# Altium schematic sheet BMS_rev2.SchDoc
size A4
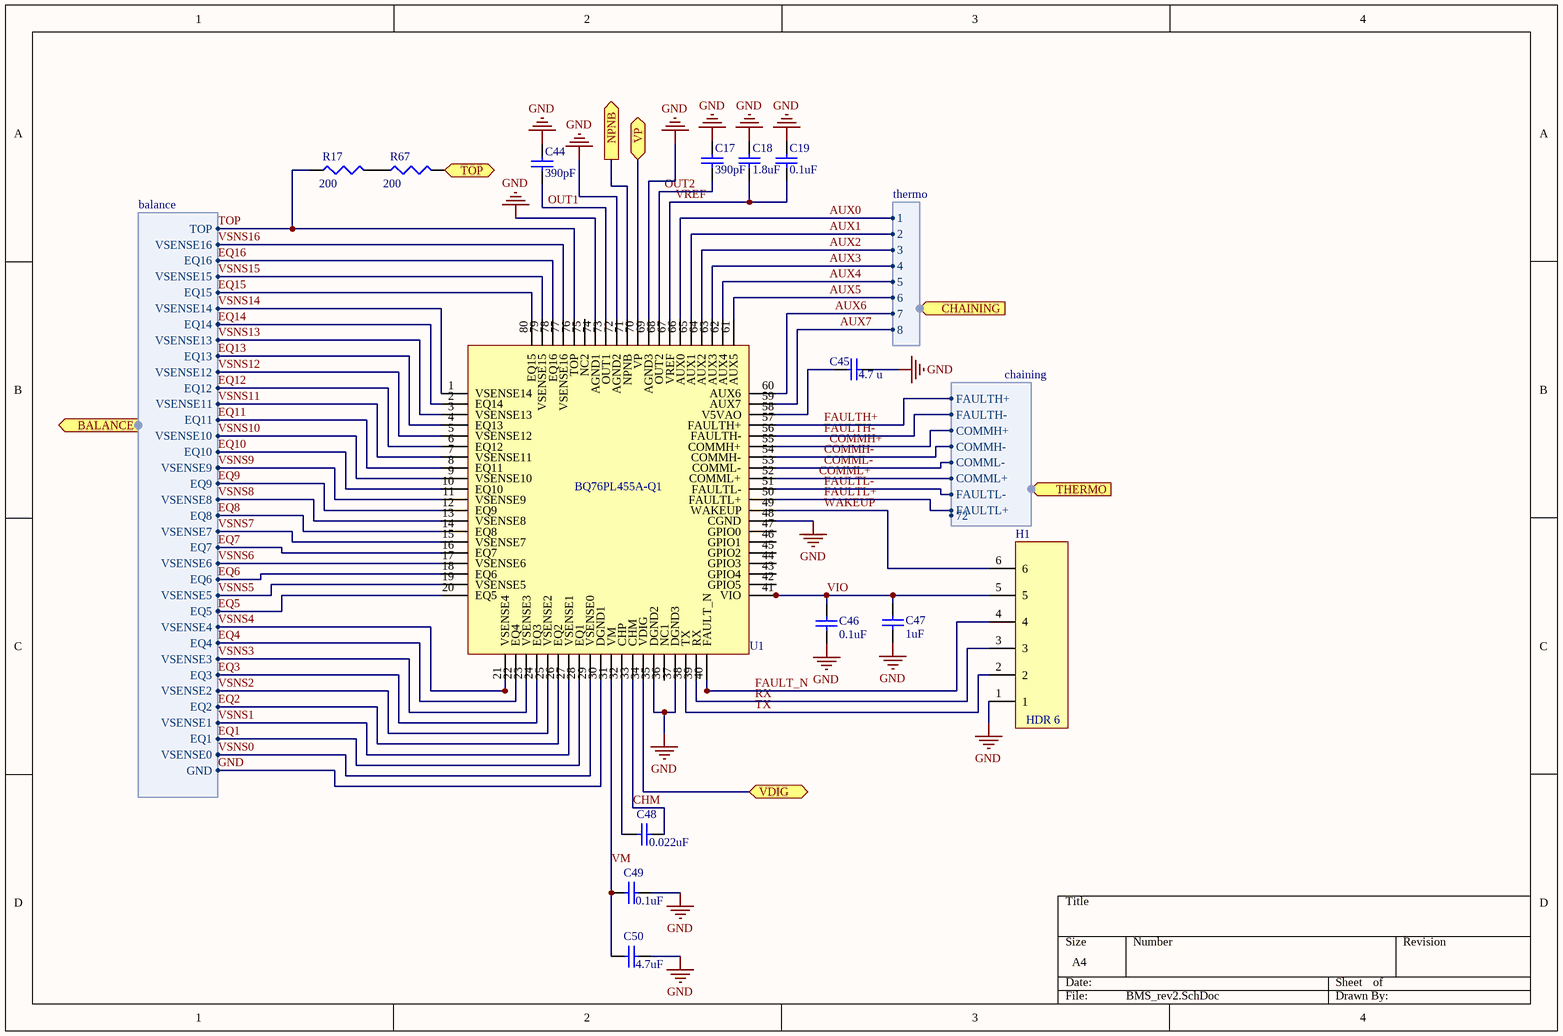
[diagram p0: BMS_rev2.SchDoc]

## Parts
C17  value 390pF  [0805 CAP]  (hidden comment: Cap Semi)
C18  value 1.8uF  [1210 cap]  (hidden comment: Cap Semi)
C19  value 0.1uF  [0603 CAP]  (hidden comment: Cap Semi)
C44  value 390pF  [0805 CAP]  (hidden comment: Cap Semi)
C45  value 4.7 u  [0805 CAP]  (hidden comment: Cap Semi)
C46  value 0.1uF  [0603 CAP]  (hidden comment: Cap Semi)
C47  value 1uF  [0603 CAP]  (hidden comment: Cap Semi)
C48  value 0.022uF  [0603 CAP]  (hidden comment: Cap Semi)
C49  value 0.1uF  [0603 CAP]  (hidden comment: Cap Semi)
C50  value 4.7uF  [0805 CAP]  (hidden comment: Cap Semi)
H1  HDR 6  [SERIAL HDR]
R17  value 200  [2512 RES]  (hidden comment: RES3)
R67  value 200  [2512 RES]  (hidden comment: RES3)
U1  BQ76PL455A-Q1  [BQ76PL455A-Q1]

## Ports
BALANCE (harness balance), CHAINING (harness thermo), NPNB, THERMO (harness chaining), TOP, VDIG, VP

## Harnesses
balance: TOP, VSENSE16, EQ16, VSENSE15, EQ15, VSENSE14, EQ14, VSENSE13, EQ13, VSENSE12, EQ12, VSENSE11, EQ11, VSENSE10, EQ10, VSENSE9, EQ9, VSENSE8, EQ8, VSENSE7, EQ7, VSENSE6, EQ6, VSENSE5, EQ5, VSENSE4, EQ4, VSENSE3, EQ3, VSENSE2, EQ2, VSENSE1, EQ1, VSENSE0, GND
chaining: FAULTH+, FAULTH-, COMMH+, COMMH-, COMML-, COMML+, FAULTL-, FAULTL+, 72
thermo: 1, 2, 3, 4, 5, 6, 7, 8

## Nets
GND: C17.1 C18.1 C19.1 C44.1 C45.2 C46.1 C47.1 C49.2 C50.2 H1.1 U1.30(DGND1) U1.35(DGND2) U1.37(DGND3) U1.48(CGND) U1.69(AGND3) U1.72(AGND2) U1.74(AGND1) ; port BALANCE.GND
AUX0: U1.66(AUX0) ; port CHAINING.1
AUX1: U1.65(AUX1) ; port CHAINING.2
AUX2: U1.64(AUX2) ; port CHAINING.3
AUX3: U1.63(AUX3) ; port CHAINING.4
AUX4: U1.62(AUX4) ; port CHAINING.5
AUX5: U1.61(AUX5) ; port CHAINING.6
AUX6: U1.60(AUX6) ; port CHAINING.7
AUX7: U1.59(AUX7) ; port CHAINING.8
CHM: C48.2 U1.33(CHM)
COMMH+: U1.55(COMMH+) ; port THERMO.COMMH+
COMMH-: U1.54(COMMH-) ; port THERMO.COMMH-
COMML+: U1.52(COMML+) ; port THERMO.COMML+
COMML-: U1.53(COMML-) ; port THERMO.COMML-
EQ1: U1.28(EQ1) ; port BALANCE.EQ1
EQ2: U1.26(EQ2) ; port BALANCE.EQ2
EQ3: U1.24(EQ3) ; port BALANCE.EQ3
EQ4: U1.22(EQ4) ; port BALANCE.EQ4
EQ5: U1.20(EQ5) ; port BALANCE.EQ5
EQ6: U1.18(EQ6) ; port BALANCE.EQ6
EQ7: U1.16(EQ7) ; port BALANCE.EQ7
EQ8: U1.14(EQ8) ; port BALANCE.EQ8
EQ9: U1.12(EQ9) ; port BALANCE.EQ9
EQ10: U1.10(EQ10) ; port BALANCE.EQ10
EQ11: U1.8(EQ11) ; port BALANCE.EQ11
EQ12: U1.6(EQ12) ; port BALANCE.EQ12
EQ13: U1.4(EQ13) ; port BALANCE.EQ13
EQ14: U1.2(EQ14) ; port BALANCE.EQ14
EQ15: U1.80(EQ15) ; port BALANCE.EQ15
EQ16: U1.78(EQ16) ; port BALANCE.EQ16
FAULT_N: H1.4 U1.40(FAULT_N)
FAULTH+: U1.57(FAULTH+) ; port THERMO.FAULTH+
FAULTH-: U1.56(FAULTH-) ; port THERMO.FAULTH-
FAULTL+: U1.50(FAULTL+) ; port THERMO.FAULTL+
FAULTL-: U1.51(FAULTL-) ; port THERMO.FAULTL-
NPNB: U1.71(NPNB) ; port NPNB
OUT1: C44.2 U1.73(OUT1)
OUT2: C17.2 U1.68(OUT2)
RX: H1.3 U1.39(RX)
TOP: R17.1 U1.76(TOP) ; port BALANCE.TOP
TOP: R67.2 ; port TOP  [a separate net that carries the same name]
TX: H1.2 U1.38(TX)
VDIG: U1.34(VDIG) ; port VDIG
VIO: C46.2 C47.2 H1.5 U1.41(VIO)
VM: C49.1 C50.1 U1.31(VM)
VP: U1.70(VP) ; port VP
VREF: C18.2 C19.2 U1.67(VREF)
VSNS0: U1.29(VSENSE0) ; port BALANCE.VSENSE0
VSNS1: U1.27(VSENSE1) ; port BALANCE.VSENSE1
VSNS2: U1.25(VSENSE2) ; port BALANCE.VSENSE2
VSNS3: U1.23(VSENSE3) ; port BALANCE.VSENSE3
VSNS4: U1.21(VSENSE4) ; port BALANCE.VSENSE4
VSNS5: U1.19(VSENSE5) ; port BALANCE.VSENSE5
VSNS6: U1.17(VSENSE6) ; port BALANCE.VSENSE6
VSNS7: U1.15(VSENSE7) ; port BALANCE.VSENSE7
VSNS8: U1.13(VSENSE8) ; port BALANCE.VSENSE8
VSNS9: U1.11(VSENSE9) ; port BALANCE.VSENSE9
VSNS10: U1.9(VSENSE10) ; port BALANCE.VSENSE10
VSNS11: U1.7(VSENSE11) ; port BALANCE.VSENSE11
VSNS12: U1.5(VSENSE12) ; port BALANCE.VSENSE12
VSNS13: U1.3(VSENSE13) ; port BALANCE.VSENSE13
VSNS14: U1.1(VSENSE14) ; port BALANCE.VSENSE14
VSNS15: U1.79(VSENSE15) ; port BALANCE.VSENSE15
VSNS16: U1.77(VSENSE16) ; port BALANCE.VSENSE16
WAKEUP: H1.6 U1.49(WAKEUP)
NetC45_1: C45.1 U1.58(V5VAO)
NetC48_1: C48.1 U1.32(CHP)
NetR17_2: R17.2 R67.1

Not connected (* = marked no-connect by the designer): U1 36(NC1) 42(GPIO5) 43(GPIO4) 44(GPIO3) 45(GPIO2) 46(GPIO1) 47(GPIO0) 75(NC2)

## Library data of the parts
C17 C44 = Cap Semi: Capacitor (Semiconductor SIM Model); Manufacturer: Kyocera AVX; Manufacturer Part Number: 08055A391JAT2A; Description: CAP CER 390PF 50V NP0 0805; Dielectric Material: Ceramic; Voltage Rating: 50V; Tolerance: 5%; Dielectric: C0G; Temperature Coefficient: 30ppm/°C; Published: 8-Jun-2000; LatestRevisionDate: 29-May-2009; LatestRevisionNote: IPC-7351 Footprint Added.; PackageReference: C1206; Publisher: Altium Limited; PackageDescription: Chip Capacitor; Supplier 1: Digi-Key; Supplier Part Number 1: 478-1323-1-ND; Stock 1: 18; Pricing 1: 1=0.22, 10=0.16, 100=0.075, 500=0.0526, 1000=0.0436 (USD); Mount: PCB,Surface Mount; Case/Package: 0805; Number of Pins: 2; Case Code (Imperial): 0805; Case Code (Metric): 2012; Contact Plating: Matte,Tin; Min Operating Temperature: -55°C; Max Operating Temperature: 125°C; Packaging: Tape and Reel; Capacitance: 390pF; Package Quantity: 1; Voltage Rating (DC): 50V; Termination: SMD/SMT; Voltage: 50V; Length: 2.01mm; Height: 0.94mm; Width: 1.25mm; Thickness: 0.037inch; Depth: 1.25mm; Radiation Hardening: No; REACH SVHC: No SVHC; Lead Free: Lead Free
C18 = Cap Semi: Capacitor (Semiconductor SIM Model); Manufacturer: KEMET; Manufacturer Part Number: C1210C185K3RACTU; Description: CAP CER 1.8UF 25V X7R 1210; Dielectric Material: Ceramic; Voltage Rating: 25V; Tolerance: 10%; Dielectric: X7R; Dissipation Factor: 3.5%; Published: 8-Jun-2000; LatestRevisionDate: 29-May-2009; LatestRevisionNote: IPC-7351 Footprint Added.; PackageReference: C1206; Publisher: Altium Limited; PackageDescription: Chip Capacitor; Supplier 1: Digi-Key; Supplier Part Number 1: 399-3082-1-ND; Stock 1: 3925; Pricing 1: 1=1.15, 10=0.876, 100=0.6267, 500=0.4852, 1000=0.4178 (USD); Mount: PCB,Surface Mount; Case/Package: 1210; Case Code (Metric): 3225; Case Code (Imperial): 1210; Min Operating Temperature: -55°C; Max Operating Temperature: 125°C; Package Quantity: 1; Capacitance: 1.8uF; Packaging: Tape and Reel; Voltage Rating (DC): 25V; Termination: SMD/SMT; Voltage: 25V; Length: 3.2mm; Height: 1.55mm; Width: 0.098inch; Thickness: 0.067inch; Depth: 2.5mm; REACH SVHC: No SVHC
C19 C46 C49 = Cap Semi: Capacitor (Semiconductor SIM Model); Manufacturer: KEMET; Manufacturer Part Number: C0603X104K3RACTU; Description: CAP CER 0.1UF 25V X7R 0603; Dielectric Material: Ceramic; Tolerance: 10%; Capacitance: 100nF; Voltage Rating: 25V; Dielectric: X7R; Dissipation Factor: 3.5%; Published: 8-Jun-2000; LatestRevisionDate: 29-May-2009; LatestRevisionNote: IPC-7351 Footprint Added.; PackageReference: C1206; Publisher: Altium Limited; PackageDescription: Chip Capacitor; Supplier 1: Digi-Key; Supplier Part Number 1: 399-5345-1-ND; Stock 1: 0; Pricing 1: 1=0.34, 10=0.237, 100=0.1423, 500=0.1067, 1000=0.0901 (USD); Mount: PCB,Surface Mount; Case/Package: 0603; Number of Pins: 2; Case Code (Imperial): 0603; Case Code (Metric): 1608; Contact Plating: Matte,Tin; Min Operating Temperature: -55°C; Max Operating Temperature: 125°C; Packaging: Tape and Reel; Package Quantity: 1; Voltage Rating (DC): 25V; Termination: SMD/SMT; Voltage: 25V; Features: Soft Termination; Length: 1.6mm; Height: 0.8mm; Width: 0.8mm; Thickness: 0.034inch; Depth: 0.8mm; Radiation Hardening: No; REACH SVHC: No SVHC
C45 = Cap Semi: Capacitor (Semiconductor SIM Model); Manufacturer: Murata; Manufacturer Part Number: GRM21BR71C475KA73L; Description: CAP CER 4.7UF 16V X7R 0805; Material: Ceramic; Capacitance: 4.7uF; Tolerance: 10%; Voltage Rating: 16V; Dielectric: X7R; Published: 8-Jun-2000; LatestRevisionDate: 29-May-2009; LatestRevisionNote: IPC-7351 Footprint Added.; PackageReference: C1206; Publisher: Altium Limited; PackageDescription: Chip Capacitor; Supplier 1: Digi-Key; Supplier Part Number 1: 490-4522-2-ND; Stock 1: 0; Pricing 1: 3000=0.1698 (USD); Mount: Surface Mount; Case/Package: 0805; Number of Pins: 2; Case Code (Metric): 2012; Case Code (Imperial): 0805; Min Operating Temperature: -55°C; Max Operating Temperature: 125°C; Packaging: Tape and Reel; Package Quantity: 1; Voltage Rating (DC): 16V; Termination: SMD/SMT; Voltage: 16V; Length: 2mm; Height: 1.25mm; Width: 0.049inch; Thickness: 0.053inch; Depth: 1.25mm; REACH SVHC: No SVHC; Lead Free: Lead Free
C47 = Cap Semi: Capacitor (Semiconductor SIM Model); Manufacturer: TDK; Manufacturer Part Number: C1608X7R1C105K080AC; Description: TDK   C1608X7R1C105K080AC   CAPACITOR CERAMIC, 1UF, 16V, X7R, 10%, 0603; Dielectric Material: Ceramic; Tolerance: 10%; Voltage Rating: 16V; Dielectric: X7R; Published: 8-Jun-2000; LatestRevisionDate: 29-May-2009; LatestRevisionNote: IPC-7351 Footprint Added.; PackageReference: C1206; Publisher: Altium Limited; PackageDescription: Chip Capacitor; Supplier 1: Digi-Key; Supplier Part Number 1: 445-1604-1-ND; Stock 1: 135; Pricing 1: 1=0.12, 10=0.087, 100=0.0387, 500=0.0277, 1000=0.0217 (USD); Mount: Surface Mount; Case/Package: 0603; Weight: 7.1E-05oz; Case Code (Metric): 1608; Case Code (Imperial): 0603; Min Operating Temperature: -55°C; Max Operating Temperature: 125°C; Packaging: Tape and Reel; Package Quantity: 1; Termination: SMD/SMT; Capacitance: 1uF; Voltage Rating (DC): 16V; Composition: Ceramic; Voltage: 16V; Length: 1.6mm; Height: 0.8mm; Width: 0.031inch; Thickness: 0.037inch; Depth: 0.8mm; Radiation Hardening: No; REACH SVHC: No SVHC; Lead Free: Lead Free
C48 = Cap Semi: Capacitor (Semiconductor SIM Model); Manufacturer: TDK; Manufacturer Part Number: C1608X7R1H223K080AA; Description: CAP CER 0.022UF 50V X7R 0603; Dielectric Material: Ceramic; Capacitance: 22nF; Tolerance: 10%; Voltage Rating: 50V; Dielectric: X7R; Published: 8-Jun-2000; LatestRevisionDate: 29-May-2009; LatestRevisionNote: IPC-7351 Footprint Added.; PackageReference: C1206; Publisher: Altium Limited; PackageDescription: Chip Capacitor; Supplier 1: Digi-Key; Supplier Part Number 1: 445-1312-1-ND; Stock 1: 0; Pricing 1: 1=0.1, 10=0.074, 100=0.0331, 500=0.0237, 1000=0.0186 (USD); Mount: Surface Mount; Case/Package: 0603; Number of Pins: 2; Weight: 7.1E-05oz; Case Code (Metric): 1608; Case Code (Imperial): 0603; Min Operating Temperature: -55°C; Max Operating Temperature: 125°C; Package Quantity: 1; Packaging: Tape and Reel; Voltage Rating (DC): 50V; Termination: SMD/SMT; Composition: Ceramic; Voltage: 50V; Length: 1.6mm; Height: 0.8mm; Width: 0.031inch; Thickness: 0.037inch; Depth: 0.8mm; Radiation Hardening: No; REACH SVHC: No SVHC; Lead Free: Lead Free
C50 = Cap Semi: Capacitor (Semiconductor SIM Model); Manufacturer: Murata; Manufacturer Part Number: GRM21BR71C475KA73L; Description: CAP CER 4.7UF 16V X7R 0805; Material: Ceramic; Tolerance: 10%; Voltage Rating: 16V; Dielectric: X7R; Published: 8-Jun-2000; LatestRevisionDate: 29-May-2009; LatestRevisionNote: IPC-7351 Footprint Added.; PackageReference: C1206; Publisher: Altium Limited; PackageDescription: Chip Capacitor; Supplier 1: Digi-Key; Supplier Part Number 1: 490-4522-2-ND; Stock 1: 0; Pricing 1: 3000=0.1698 (USD); Mount: Surface Mount; Case/Package: 0805; Number of Pins: 2; Case Code (Metric): 2012; Case Code (Imperial): 0805; Min Operating Temperature: -55°C; Max Operating Temperature: 125°C; Capacitance: 4.7uF; Packaging: Tape and Reel; Package Quantity: 1; Voltage Rating (DC): 16V; Termination: SMD/SMT; Voltage: 16V; Length: 2mm; Height: 1.25mm; Width: 0.049inch; Thickness: 0.053inch; Depth: 1.25mm; REACH SVHC: No SVHC; Lead Free: Lead Free
H1 = HDR 6: Manufacturer: Molex; Manufacturer Part Number: 0022124062; Contact Resistance: 10mR; Number of Positions: 6; Gender: Male; Connector Type: Male Pin; Pitch: 2.54mm; Supplier 1: Digi-Key; Supplier Part Number 1: WM13446-ND; Stock 1: 3075; Pricing 1: 1=1.06, 10=0.934, 100=0.8059, 500=0.6593, 1000=0.5861, 5000=0.5128, 10000=0.4872 (USD); Mount: Through Hole; Contact Plating: Gold; Contact Material: Brass; Colour: Natural; Housing Material: Nylon; Housing Colour: Natural; Min Operating Temperature: 0°C; Max Operating Temperature: 75°C; Package Quantity: 1000; Number of Rows: 1; Packaging: Bulk; Termination: Solder; Number of Contacts: 6; Orientation: Right Angle; Fastening Type: Friction; Length: 15.24mm; Contact Mating Length: 0.264inch; Depth: 14.42mm
R17 R67 = RES3: Resistor; Manufacturer: Vishay Dale; Manufacturer Part Number: CRCW2512200RJNEG; Description: RES SMD 200 OHM 5% 1W 2512; Resistance: 200R; Tolerance: 5%; Power Rating: 1W; Voltage Rating: 500V; Temperature Coefficient: 200ppm/°C; Published: 8-Jun-2000; LatestRevisionDate: 29-May-2009; LatestRevisionNote: IPC-7351 Footprint Added.; PackageReference: J1-0603; Publisher: Altium Limited; PackageDescription: Chip Resistor; Supplier 1: Digi-Key; Supplier Part Number 1: 541-200XCT-ND; Stock 1: 1091; Pricing 1: 1=0.39, 10=0.333, 100=0.1301, 1000=0.0545 (USD); Mount: Surface Mount; Case/Package: 2512; Number of Pins: 2; Weight: 0.001429oz; Case Code (Metric): 6432; Case Code (Imperial): 2512; Contact Plating: Tin; Min Operating Temperature: -55°C; Max Operating Temperature: 155°C; Packaging: Tape and Reel; Package Quantity: 2000; Composition: Thick Film; Number of Terminations: 2; Termination: SMD/SMT; Military Standard: Not; Max Power Dissipation: 1W; Voltage Rating (DC): 500V; Working Voltage: 500V; Features: Automotive AEC-Q200; Length: 6.3mm; Height: 0.6mm; Width: 0.124inch; Depth: 3.15mm; Radiation Hardening: No; REACH SVHC: Unknown; Lead Free: Lead Free
U1 = BQ76PL455A-Q1: Manufacturer: Texas Instruments; Manufacturer Part Number: BQ76PL455ATPFCRQ1; Interface: UART; Fault Protection: Over/Under Voltage; Operating Supply Voltage: 22V; Supplier 1: Digi-Key; Stock 1: 0; Pricing 1: 1=19.03, 10=17.486, 100=14.7676, 500=13.1368 (USD); Mount: Surface Mount; Case/Package: TQFP; Number of Pins: 80; Min Operating Temperature: -40°C; Max Operating Temperature: 105°C; Packaging: Tape and Reel; Lead Free: Lead Free; Supplier Part Number 1: 296-44049-1-ND